# Altium schematic sheet POWER_SUPPLY.SchDoc
size A; SheetNumber: 6; SheetTotal: 6
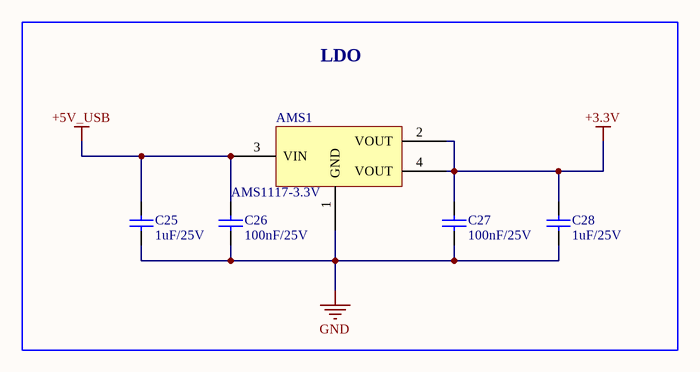
[diagram p0: POWER_SUPPLY.SchDoc]

## Parts
AMS1  AMS1117-3.3V  [SOT223]
C25  value 1uF/25V  [CAP-SM-0805]  (hidden comment: Cap Non-Pol SMD)
C26  value 100nF/25V  [CAP-SM-0805]  (hidden comment: Cap Non-Pol SMD)
C27  value 100nF/25V  [CAP-SM-0805]  (hidden comment: Cap Non-Pol SMD)
C28  value 1uF/25V  [CAP-SM-0805]  (hidden comment: Cap Non-Pol SMD)

## Blocks framed on the sheet
LDO: AMS1 C25-C28

## Nets
+3.3V: AMS1.2(VOUT) AMS1.4(VOUT) C27.2 C28.2
+5V_USB: AMS1.3(VIN) C25.2 C26.2
GND: AMS1.1(GND) C25.1 C26.1 C27.1 C28.1

## Library data of the parts
AMS1 = AMS1117 SMD: Dán; Value: AMS1117-3.3V SOT223; Don_Vi: Con; Ma_Hang: MH000596; Ghi_Chu: *; Kieu_Chan: *; Chung_Loai: Dán
C25-C28 = Cap Non-Pol SMD: Capacitor